# Altium schematic sheet LDO_3V3.SchDoc
size A4; SheetNumber: 6; SheetTotal: 8; SPICEModelCacheBPWODVRE: <root> / <DocumentId>BPWODVRE</DocumentId> / <CacheFrame Number="0"> / <Model Name="res" Kind="MDL"> / <Text>*Default semiconductor resistor / .MODEL RES R()</Text> / </Model> / <Model Name="cap" Kind="MDL"> / <Text>*Default semiconductor capacitor / .MODEL CAP C()</Text> / </Model> / </CacheFrame> / </root>
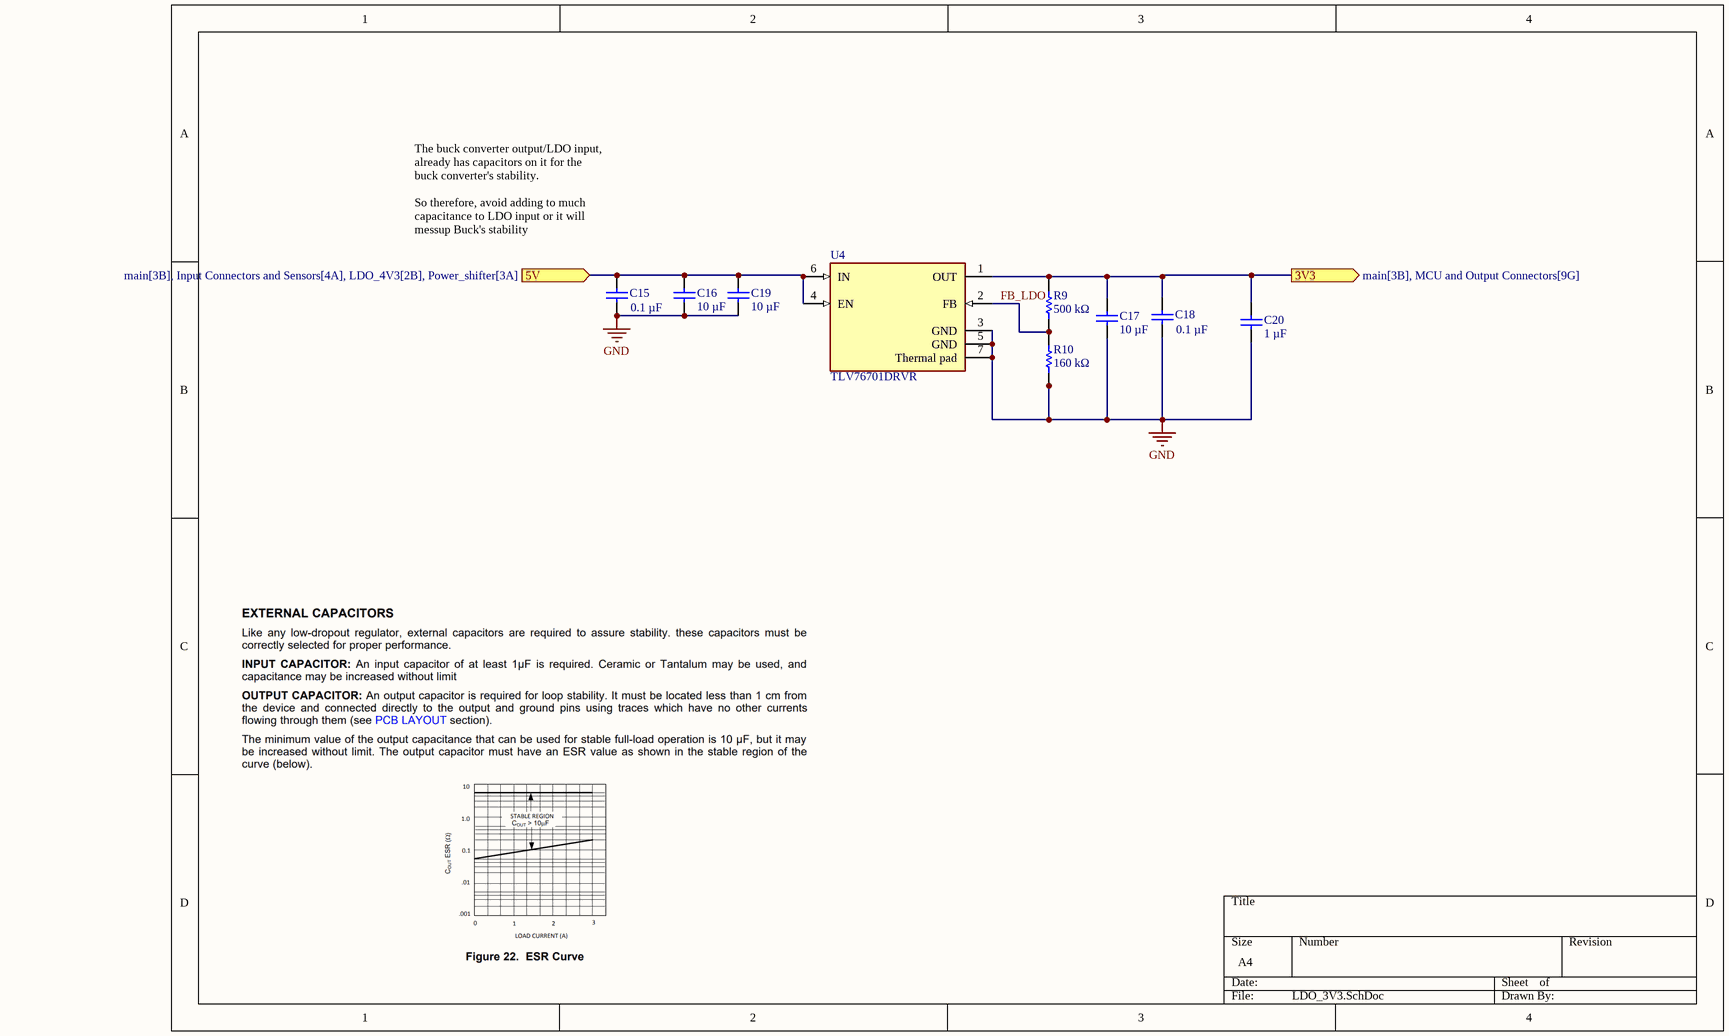
[diagram p0: LDO_3V3.SchDoc]

## Parts
C15  0.1 µF  [0402_CAPC1005L]
C16  10 µF  [1210_CAPC3225L]
C17  10 µF  [1210_CAPC3225L]
C18  0.1 µF  [0402_CAPC1005L]
C19  10 µF  [1210_CAPC3225L]
C20  1 µF  [0603_CAPC1608L]
R9  value 500 kΩ  [0402_RESC1005L]  (hidden comment: Res Semi)
R10  value 160 kΩ  [0402_RESC1005L]  (hidden comment: Res Semi)
U4  TLV76701DRVR  [FP-DRV0006A-IPC_C]

## Ports
3V3 (out, see main[3B], MCU and Output Connectors[9G]), 5V (in, see main[3B], Input Connectors and Sensors[4A], LDO_4V3[2B], Power_shifter[3A])

## Nets
GND: C15.1 C16.2 C17.2 C18.1 C19.2 C20.2 R10.1 U4.3(GND) U4.5(GND) U4.7(Thermal_pad)
3V3: C17.1 C18.2 C20.1 R9.2 U4.1(OUT) ; port 3V3
5V: C15.2 C16.1 C19.1 U4.4(EN) U4.6(IN) ; port 5V
FB_LDO: R9.1 R10.2 U4.2(FB)

## Notes on the sheet
- The buck converter output/LDO input, already has capacitors on it for the buck converter's stability.
  So therefore, avoid adding to much capacitance to LDO input or it will messup Buck's stability

## Library data of the parts
C15-C20 = Cap Semi: Capacitor (Semiconductor SIM Model); Published: 8-Jun-2000; LatestRevisionDate: 29-May-2009; LatestRevisionNote: IPC-7351 Footprint Added.; PackageReference: C1206; Publisher: Altium Limited; PackageDescription: Chip Capacitor; Digikey part#: *; Manufacturer: *; Manufacturer part#: *
  C15 C18: Value: 0.1 µF
  C16 C17 C19: Value: 10 µF
  C20: Value: 1 µF
R9 R10 = Res Semi: Semiconductor Resistor; Published: 8-Jun-2000; LatestRevisionDate: 17-Jul-2002; LatestRevisionNote: Re-released for DXP Platform.; PackageReference: AXIAL-0.5; Publisher: Altium Limited; Digikey part#: *; Manufacturer: *; Manufacturer part#: *
U4 = CMP-04917-000172-1: IC REG LINEAR POS ADJ 1A 6WSON